# EAGLE design logic (EAGLE 5.07)
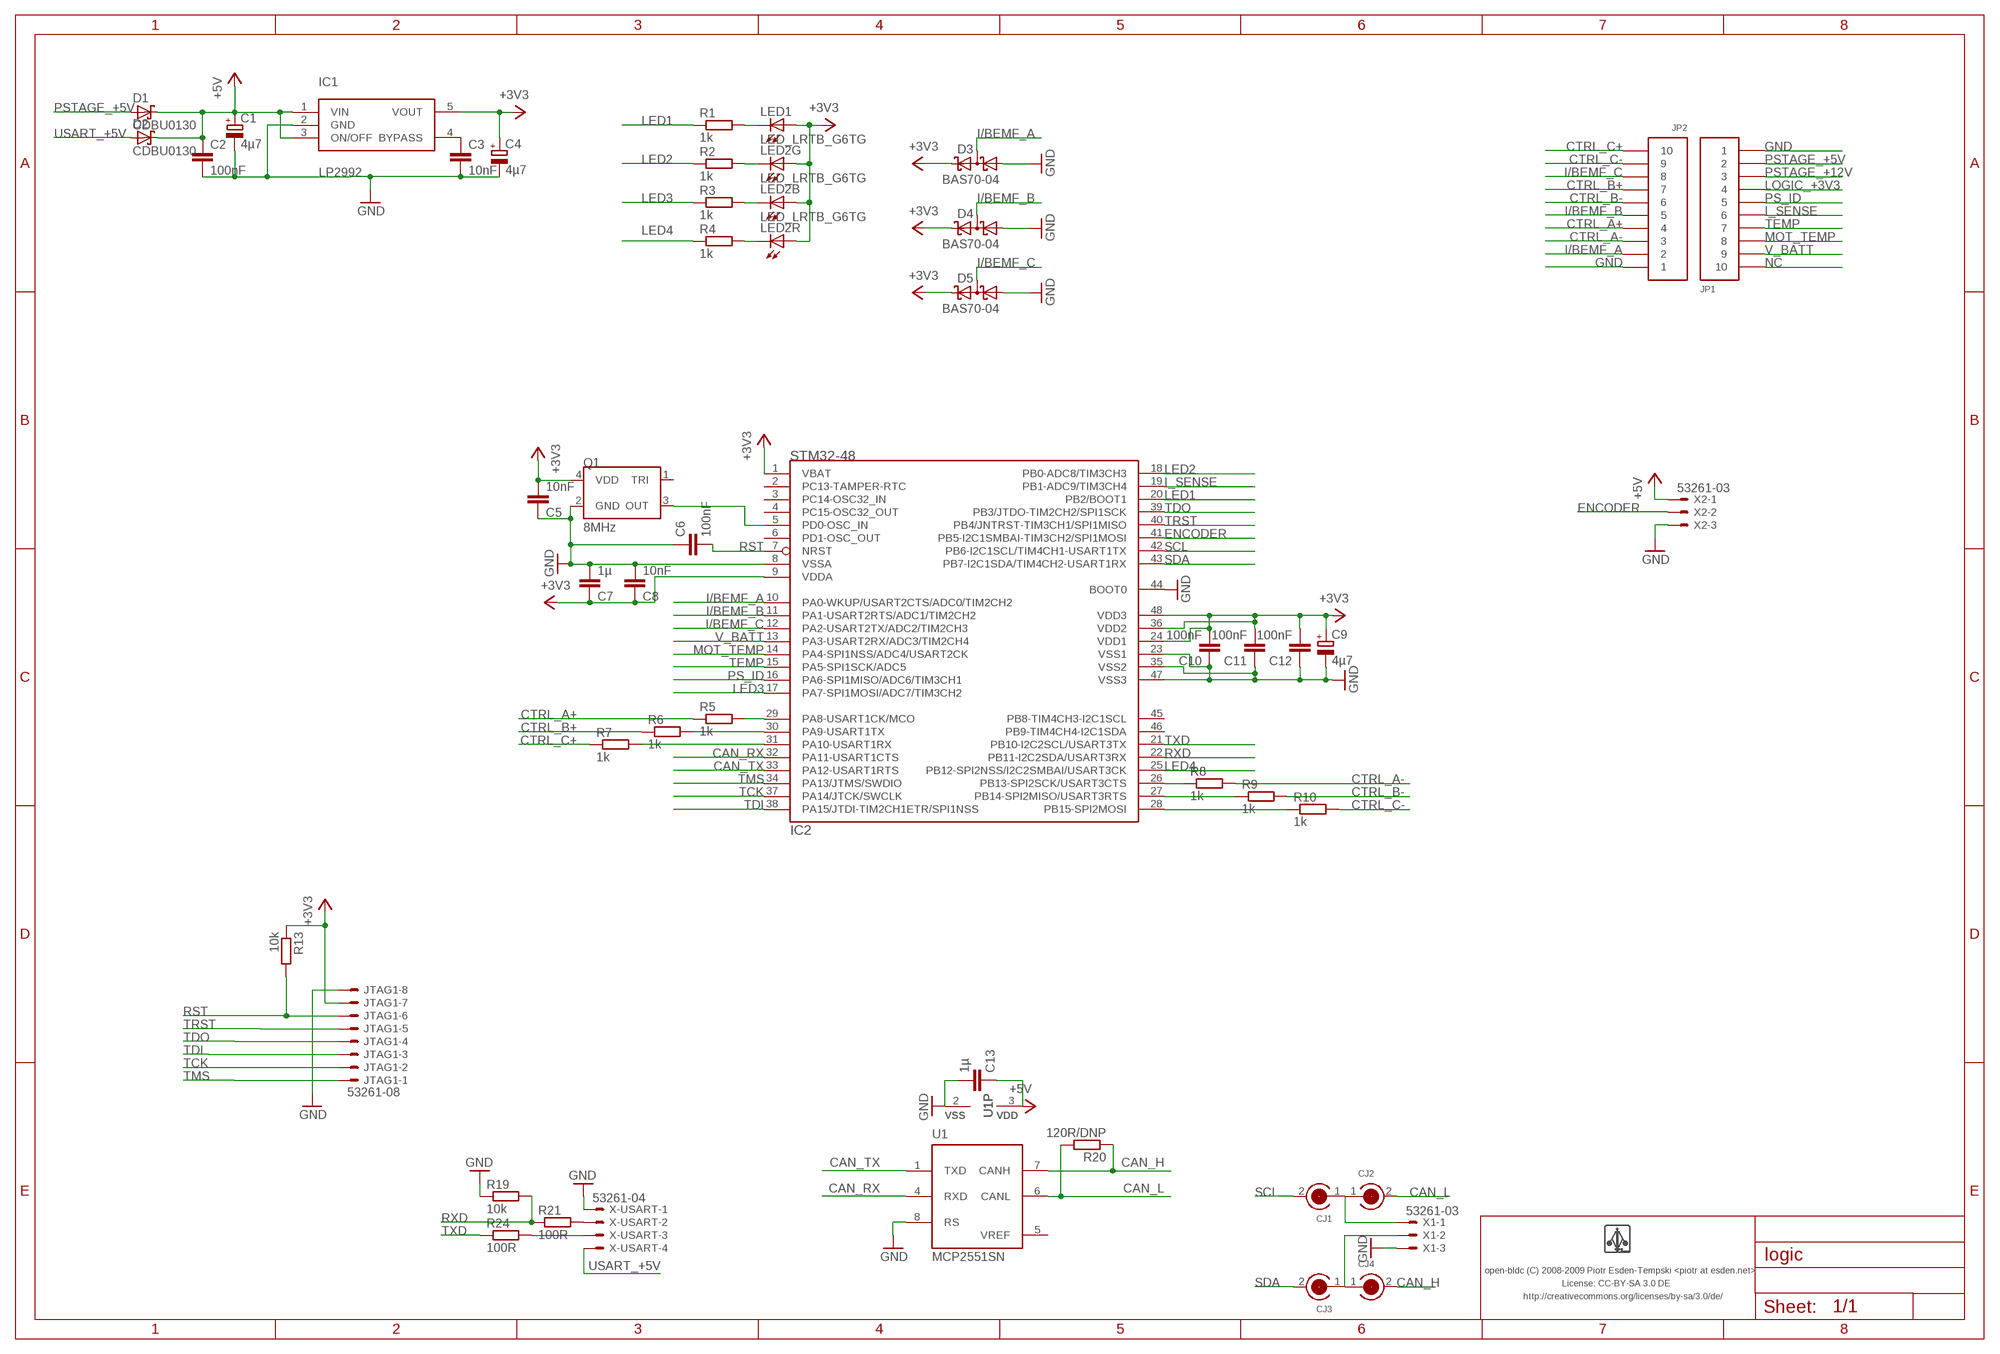
[diagram p0: schematic, sheet 1]

## Parts
C1  4µ7  CPOL-EUA/3216-18R  [A/3216-18R]
C2  100nF  C-EUC0603  [C0603]
C3  10nF  C-EUC0603  [C0603]
C4  4µ7  CPOL-EUA/3216-18R  [A/3216-18R]
C5  10nF  C-EUC0603  [C0603]
C6  100nF  C-EUC0603  [C0603]
C7  1µ  C-EUC0603  [C0603]
C8  10nF  C-EUC0603  [C0603]
C9  4µ7  CPOL-EUA/3216-18R  [A/3216-18R]
C10  100nF  C-EUC0603  [C0603]
C11  100nF  C-EUC0603  [C0603]
C12  100nF  C-EUC0603  [C0603]
C13  1µ  C-EUC0603  [C0603]
CJ1  CIRC_JMP  [CIRC_JMP]
CJ2  CIRC_JMP  [CIRC_JMP]
CJ3  CIRC_JMP  [CIRC_JMP]
CJ4  CIRC_JMP  [CIRC_JMP]
D1  CDBU0130  SCHOTTKY-DIODE0603  [SOD523]
D2  CDBU0130  SCHOTTKY-DIODE0603  [SOD523]
D3  BAS70-04  [SOT23]
D4  BAS70-04  [SOT23]
D5  BAS70-04  [SOT23]
IC1  LP2992  [SOT23-5]
IC2  STM32-48  [LQFP48]
JP1  PIN_HDR_1.27MM_10  PIN_HDR_1.27MM_10_TH  [PIN_HDR_1.27MM_10]
JP2  PIN_HDR_1.27MM_10  PIN_HDR_1.27MM_10_TH  [PIN_HDR_1.27MM_10]
JTAG1  53261-08  [53261-08]
LED1  AMBER  LEDCHIP-LED0603  [CHIP-LED0603]
LED2  LED_LRTB_G6TG  [PLCC6]
Q1  8MHz  ASE_ASCILLATOR  [ASE_OSCILLATOR]
R1  1k  R-EU_R0603  [R0603]
R2  1k  R-EU_R0603  [R0603]
R3  1k  R-EU_R0603  [R0603]
R4  1k  R-EU_R0603  [R0603]
R5  1k  R-EU_R0603  [R0603]
R6  1k  R-EU_R0603  [R0603]
R7  1k  R-EU_R0603  [R0603]
R8  1k  R-EU_R0603  [R0603]
R9  1k  R-EU_R0603  [R0603]
R10  1k  R-EU_R0603  [R0603]
R13  10k  R-EU_R0603  [R0603]
R19  10k  R-EU_R0603  [R0603]
R20  120R/DNP  R-EU_R0603  [R0603]
R21  100R  R-EU_R0603  [R0603]
R24  100R  R-EU_R0603  [R0603]
U1  MCP2551SN  [SO-08]
U$1  LOGO  [LOGO]
X1  53261-03  [53261-03]
X2  53261-03  [53261-03]
X-USART  53261-04  [53261-04]

## Nets
+3V3: C4.+ C5.2 C7.1 C8.1 C9.+ C10.2 C11.2 C12.2 D3.2(C2) D4.2(C2) D5.2(C2) IC1.5(VOUT) IC2.1(VBAT) IC2.9(VDDA) IC2.24(VDD1) IC2.36(VDD2) IC2.48(VDD3) JTAG1.7 LED1.A LED2.A1(R:A) LED2.A2(G:A) LED2.A3(B:A) Q1.4(VDD) R13.1
+5V: C1.+ C2.1 C13.1 D1.C D2.C IC1.1(VIN) IC1.3(ON/OFF) U1.3(VDD) X2.1
CAN_H: CJ4.2 R20.1 U1.7(CANH)
CAN_L: CJ2.2 R20.2 U1.6(CANL)
CAN_RX: IC2.32(PA11-USART1CTS) U1.4(RXD)
CAN_TX: IC2.33(PA12-USART1RTS) U1.1(TXD)
CTRL_A+: JP2.P$4 R5.1
CTRL_A-: JP2.P$3 R8.2
CTRL_B+: JP2.P$7 R6.1
CTRL_B-: JP2.P$6 R9.2
CTRL_C+: JP2.P$10 R7.1
CTRL_C-: JP2.P$9 R10.2
ENCODER: IC2.41(PB5-I2C1SMBAI-TIM3CH2/SPI1MOSI) X2.2
GND: C1.- C2.2 C3.2 C4.- C5.1 C6.1 C7.2 C8.2 C9.- C10.1 C11.1 C12.1 C13.2 D3.1(A1) D4.1(A1) D5.1(A1) IC1.2(GND) IC2.8(VSSA) IC2.23(VSS1) IC2.35(VSS2) IC2.44(BOOT0) IC2.47(VSS3) JP1.P$1 JP2.P$1 JTAG1.8 Q1.2(GND) R19.1 U1.2(VSS) U1.8(RS) X1.3 X2.3 X-USART.1
I/BEMF_A: D3.3(C1A2) IC2.10(PA0-WKUP/USART2CTS/ADC0/TIM2CH2) JP2.P$2
I/BEMF_B: D4.3(C1A2) IC2.11(PA1-USART2RTS/ADC1/TIM2CH2) JP2.P$5
I/BEMF_C: D5.3(C1A2) IC2.12(PA2-USART2TX/ADC2/TIM2CH3) JP2.P$8
I_SENSE: IC2.19(PB1-ADC9/TIM3CH4) JP1.P$6
LED1: IC2.20(PB2/BOOT1) R1.1
LED2: IC2.18(PB0-ADC8/TIM3CH3) R2.1
LED3: IC2.17(PA7-SPI1MOSI/ADC7/TIM3CH2) R3.1
LED4: IC2.25(PB12-SPI2NSS/I2C2SMBAI/USART3CK) R4.1
LOGIC_+3V3: JP1.P$4
MOT_TEMP: IC2.14(PA4-SPI1NSS/ADC4/USART2CK) JP1.P$8
N$1: CJ3.1 CJ4.1 X1.2
N$2: CJ1.1 CJ2.1 X1.1
N$3: LED1.C R1.2
N$4: LED2.C1(R:C) R4.2
N$5: LED2.C3(B:C) R3.2
N$9: R21.2 X-USART.2
N$10: LED2.C2(G:C) R2.2
N$20: R24.2 X-USART.3
N$22: C3.1 IC1.4(BYPASS)
N$33: IC2.26(PB13-SPI2SCK/USART3CTS) R8.1
N$36: IC2.27(PB14-SPI2MISO/USART3RTS) R9.1
N$39: IC2.28(PB15-SPI2MOSI) R10.1
N$40: IC2.5(PD0-OSC_IN) Q1.3(OUT)
N$41: IC2.29(PA8-USART1CK/MCO) R5.2
N$42: IC2.30(PA9-USART1TX) R6.2
N$45: IC2.31(PA10-USART1RX) R7.2
NC: JP1.P$10
PS_ID: IC2.16(PA6-SPI1MISO/ADC6/TIM3CH1) JP1.P$5
PSTAGE_+5V: D1.A JP1.P$2
PSTAGE_+12V: JP1.P$3
RST: C6.2 IC2.7(NRST) JTAG1.6 R13.2
RXD: IC2.22(PB11-I2C2SDA/USART3RX) R19.2 R21.1
SCL: CJ1.2 IC2.42(PB6-I2C1SCL/TIM4CH1-USART1TX)
SDA: CJ3.2 IC2.43(PB7-I2C1SDA/TIM4CH2-USART1RX)
TCK: IC2.37(PA14/JTCK/SWCLK) JTAG1.2
TDI: IC2.38(PA15/JTDI-TIM2CH1ETR/SPI1NSS) JTAG1.3
TDO: IC2.39(PB3/JTDO-TIM2CH2/SPI1SCK) JTAG1.4
TEMP: IC2.15(PA5-SPI1SCK/ADC5) JP1.P$7
TMS: IC2.34(PA13/JTMS/SWDIO) JTAG1.1
TRST: IC2.40(PB4/JNTRST-TIM3CH1/SPI1MISO) JTAG1.5
TXD: IC2.21(PB10-I2C2SCL/USART3TX) R24.1
USART_+5V: D2.A X-USART.4
V_BATT: IC2.13(PA3-USART2RX/ADC3/TIM2CH4) JP1.P$9
Unconnected: IC2.2(PC13-TAMPER-RTC) IC2.3(PC14-OSC32_IN) IC2.4(PC15-OSC32_OUT) IC2.6(PD1-OSC_OUT) IC2.45(PB8-TIM4CH3-I2C1SCL) IC2.46(PB9-TIM4CH4-I2C1SDA) Q1.1(TRI)

## Notes on the sheet
- open-bldc (C) 2008-2009 Piotr Esden-Tempski <piotr at esden.net>
- License: CC-BY-SA 3.0 DE
- http://creativecommons.org/licenses/by-sa/3.0/de/

## Power pins joined to a net without a drawn wire
VREF: U1.5(VREF)

## Library data of the parts
C1 C4 C9 = rcl:CPOL-EU: POLARIZED CAPACITOR, European symbol
C2 C3 C5-C8 C10-C13 = rcl:C-EU: CAPACITOR, European symbol
CJ1-CJ4 = fancy_jumpers:CIRC_JMP
D1 D2 = diode:SCHOTTKY-DIODE: Schottky Diode
D3-D5 = diode:BAS70-04: Silicon Schottky Diodes General-purpose diode for high-speed switching
IC1 = open-bldc:LP2992
IC2 = open-bldc:STM32-48
JP1 JP2 = open-bldc:PIN_HDR_1.27MM_10
JTAG1 = con-molex:53?-08: CONNECTOR wire to board 1.25 mm (.049 inch) pitch header
LED1 = led:LED: LED OSRAM: - CHIPLED LG R971, LG N971, LY N971, LG Q971, LY Q971, LO R971, LY R971 LH N974, LH R974 LS Q976, LO Q976, LY Q976 LO Q996 - Hyper CHIPLED LW Q18S LB Q993, LB Q99A, LB R99A - SideLED LS A670, LO A670, LY A670, LG A670, LP A670 LB A673, LV A673, LT A673, LW A673 LH A674 LY A675 LS A676, LA A676, LO A676, LY A676, LW A676 LS A679, LY A679, LG A679 - Hyper Micro SIDELED® LS Y876, LA Y876, LO Y876, LY Y876 LT Y87S - SmartLED LW L88C, LW L88S LB L89C, LB L89S, LG L890 LS L89K, LO L89K, LY L89K LS L896, LA L896, LO L896, LY L896 - TOPLED LS T670, LO T670, LY T670, LG T670, LP T670 LSG T670, LSP T670, LSY T670, LOP T670, LYG T670 LG T671, LOG T671, LSG T671 LB T673, LV T673, LT T673, LW T673 LH T674 LS T676, LA T676, LO T676, LY T676, LB T676, LH T676, LSB T676, LW T676 LB T67C, LV T67C, LT T67C, LS T67K, LO T67K, LY T67K, LW E67C LS E67B, LA E67B, LO E67B, LY E67B, LB E67C, LV E67C, LT E67C LW T67C LS T679, LY T679, LG T679 LS T770, LO T770, LY T770, LG T770, LP T770 LB T773, LV T773, LT T773, LW T773 LH T774 LS E675, LA E675, LY E675, LS T675 LS T776, LA T776, LO T776, LY T776, LB T776 LHGB T686 LT T68C, LB T68C - Hyper Mini TOPLED® LB M676 - Mini TOPLED Santana® LG M470 LS M47K, LO M47K, LY M47K Source: http://www.osram.convergy.de LUXEON: - LUMILED® LXK2-PW12-R00, LXK2-PW12-S00, LXK2-PW14-U00, LXK2-PW14-V00 LXK2-PM12-R00, LXK2-PM12-S00, LXK2-PM14-U00 LXK2-PE12-Q00, LXK2-PE12-R00, LXK2-PE12-S00, LXK2-PE14-T00, LXK2-PE14-U00 LXK2-PB12-K00, LXK2-PB12-L00, LXK2-PB12-M00, LXK2-PB14-N00, LXK2-PB14-P00, LXK2-PB14-Q00 LXK2-PR12-L00, LXK2-PR12-M00, LXK2-PR14-Q00, LXK2-PR14-R00 LXK2-PD12-Q00, LXK2-PD12-R00, LXK2-PD12-S00 LXK2-PH12-R00, LXK2-PH12-S00 LXK2-PL12-P00, LXK2-PL12-Q00, LXK2-PL12-R00 Source: www.luxeon.com KINGBRIGHT: KA-3528ASYC Source: www.kingbright.com
LED2 = open-bldc:LED_LRTB_G6TG
Q1 = open-bldc:ASE_ASCILLATOR
R1-R10 R19-R21 R24 = rcl:R-EU_: RESISTOR, European symbol
R13 = resistor:R-EU_: RESISTOR, European symbol
U1 = microchip_can:MCP2551: High Speed CAN tranceiver
U$1 = open-bldc:LOGO
X1 X2 = con-molex:53?-03: CONNECTOR wire to board 1.25 mm (.049 inch) pitch header
X-USART = con-molex:53?-04: CONNECTOR wire to board 1.25 mm (.049 inch) pitch header

## Board
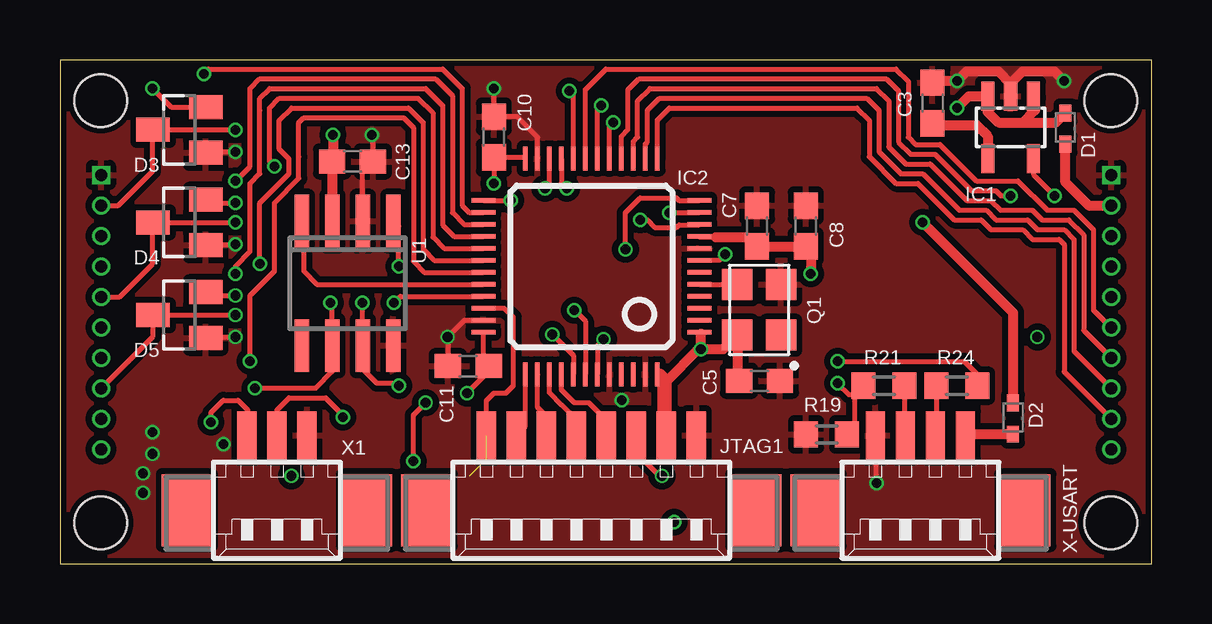
[diagram p1: board, top side]
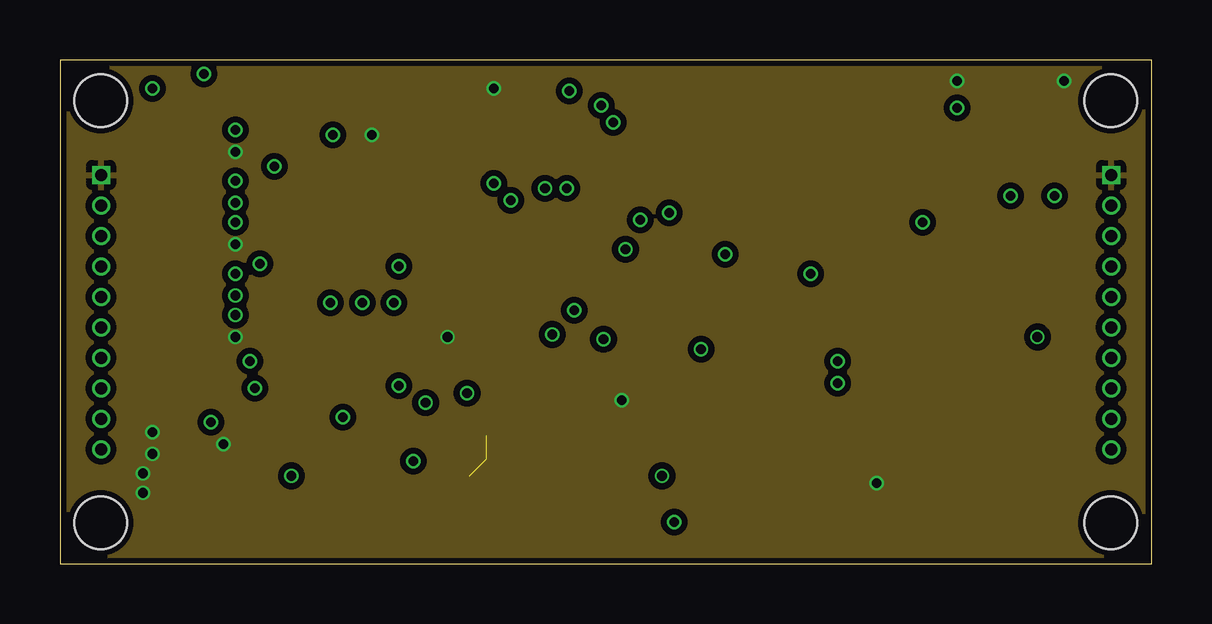
[diagram p2: board, inner layer Route2]
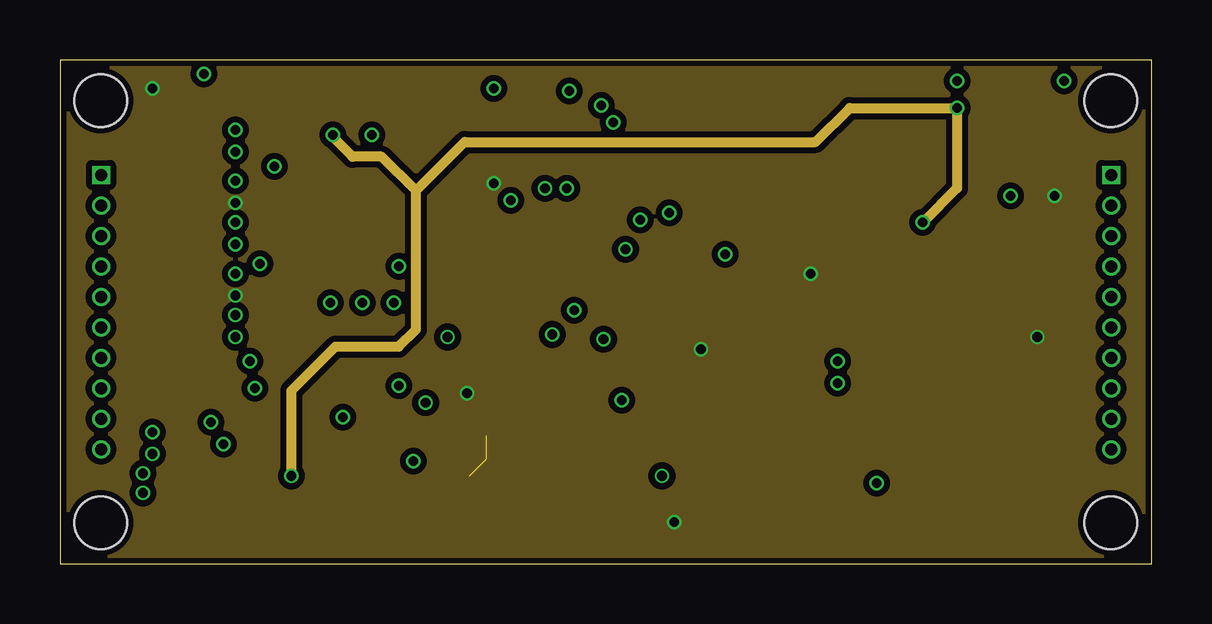
[diagram p3: board, inner layer Route15]
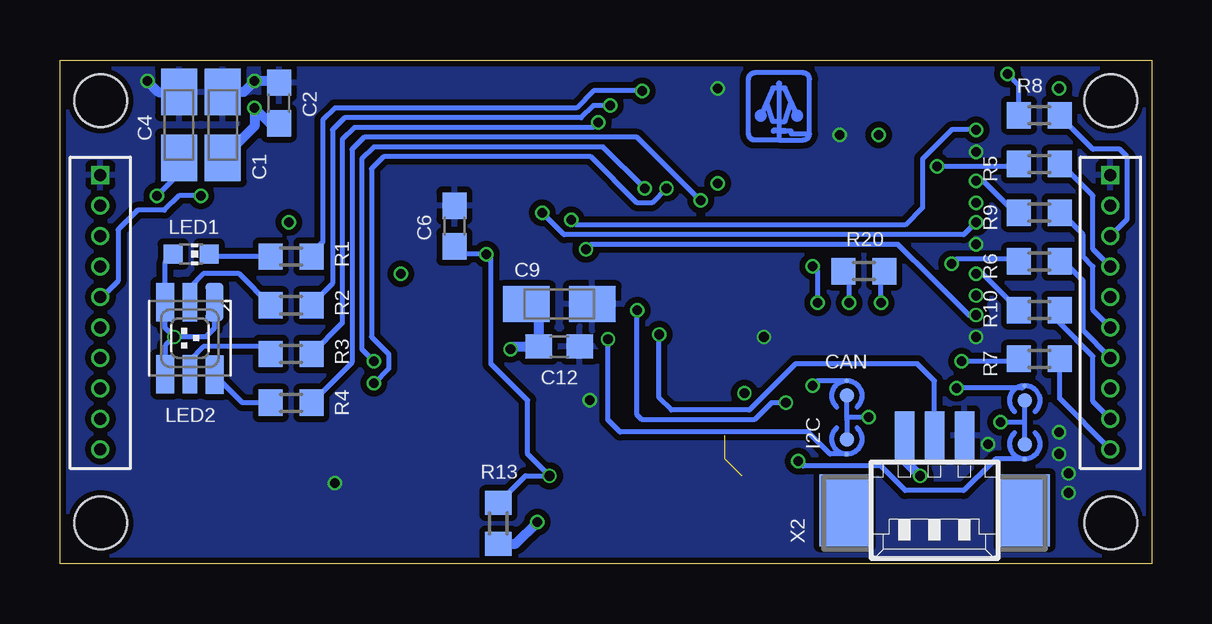
[diagram p4: board, bottom side, seen from below]

Size 45.5 x 21 mm. Coordinates in mm from the lower left corner, seen from the top.
Outline: 0,0 45.5,0 45.5,21 0,21 0,0
Copper layers (1*2+15*16): Top 0.035mm / dielectric 0.75mm / Route2 0.035mm / dielectric 0.15mm / Route15 0.035mm / dielectric 0.75mm / Bottom 0.035mm
Design rules "default *": minimum track width 8mil, minimum drill 0.4mm, track to track 8mil, track to pad 8mil, pad to pad 8mil, via to via 8mil, smd to smd 8mil, copper to edge 10mil, drill to drill 8mil, minimum pad ring 0.1mm, minimum via ring 0.1mm, stop-mask expansion 4mil, vias tented up to drill 16mil, thermal gap 10mil
Holes 2.2 mm at 1.7,1.7 43.8,1.7 43.8,19.3 1.7,19.3

### Footprints (pad centres in the part's own frame; a part is rotated, then mirrored left to right if it is on the bottom)
A/3216-18R = smd 1.95 x 1.5: + 1.375,0; - -1.375,0
C0603 = smd 1.1 x 1: 1 -0.85,0; 2 0.85,0
CIRC_JMP = smd 0.61 x 0.61: 1 0,0 | smd 0.203 x 0.203: 2 0,0.617
SOD523 = smd 0.7 x 0.5: A 0.7,0; C -0.6,0
SOT23 = smd 1 x 1.4: 1 -0.95,-1.1; 2 0.95,-1.1; 3 0,1.1
SOT23-5 = smd 0.55 x 1.2: 1 -0.95,-1.3; 2 0,-1.3; 3 0.95,-1.3; 4 0.95,1.3; 5 -0.95,1.3
LQFP48 = smd 0.2 x 1: 1 -2.75,-4.5; 2 -2.25,-4.5; 3 -1.75,-4.5; 4 -1.25,-4.5; 5 -0.75,-4.5; 6 -0.25,-4.5; 7 0.25,-4.5; 8 0.75,-4.5; 9 1.25,-4.5; 10 1.75,-4.5; 11 2.25,-4.5; 12 2.75,-4.5; 25 2.75,4.5; 26 2.25,4.5; 27 1.75,4.5; 28 1.25,4.5; 29 0.75,4.5; 30 0.25,4.5; 31 -0.25,4.5; 32 -0.75,4.5; 33 -1.25,4.5; 34 -1.75,4.5; 35 -2.25,4.5; 36 -2.75,4.5 | smd 1 x 0.2: 13 4.5,-2.75; 14 4.5,-2.25; 15 4.5,-1.75; 16 4.5,-1.25; 17 4.5,-0.75; 18 4.5,-0.25; 19 4.5,0.25; 20 4.5,0.75; 21 4.5,1.25; 22 4.5,1.75; 23 4.5,2.25; 24 4.5,2.75; 37 -4.5,2.75; 38 -4.5,2.25; 39 -4.5,1.75; 40 -4.5,1.25; 41 -4.5,0.75; 42 -4.5,0.25; 43 -4.5,-0.25; 44 -4.5,-0.75; 45 -4.5,-1.25; 46 -4.5,-1.75; 47 -4.5,-2.25; 48 -4.5,-2.75
PIN_HDR_1.27MM_10 = drill 0.5 square: P$1 0,0 | drill 0.5 round: P$2 0,1.27; P$3 0,2.54; P$4 0,3.81; P$5 0,5.08; P$6 0,6.35; P$7 0,7.62; P$8 0,8.89; P$9 0,10.16; P$10 0,11.43
53261-08 = smd 0.8 x 2: 1 4.375,-2.5; 2 3.125,-2.5; 3 1.875,-2.5; 4 0.625,-2.5; 5 -0.625,-2.5; 6 -1.875,-2.5; 7 -3.125,-2.5; 8 -4.375,-2.5 | smd 2.1 x 3: S1 6.875,0.625; S2 -6.875,0.625
CHIP-LED0603 = smd 0.8 x 0.8: A 0,-0.75; C 0,0.75
PLCC6 = smd 0.75 x 1.6: A1 -1.025,-1.5; A2 1.025,-1.5; A3 1.025,1.5; C1 -1.025,1.525 | smd 0.6 x 1.6: C2 0,-1.5; C3 0,1.5
ASE_OSCILLATOR = smd 1.295 x 1.27: 1 -1.041,-0.902; 2 1.067,-0.902; 3 1.067,0.927; 4 -1.041,0.927
R0603 = smd 1 x 1.1: 1 -0.85,0; 2 0.85,0
SO-08 = smd 0.6 x 2.2: 1 -1.905,-2.6; 2 -0.635,-2.6; 3 0.635,-2.6; 4 1.905,-2.6; 5 1.905,2.6; 6 0.635,2.6; 7 -0.635,2.6; 8 -1.905,2.6
53261-03 = smd 0.8 x 2: 1 1.25,-2.5; 2 0,-2.5; 3 -1.25,-2.5 | smd 2.1 x 3: S1 3.75,0.625; S2 -3.75,0.625
53261-04 = smd 0.8 x 2: 1 1.875,-2.5; 2 0.625,-2.5; 3 -0.625,-2.5; 4 -1.875,-2.5 | smd 2.1 x 3: S1 4.375,0.625; S2 -4.375,0.625

### Placement (x,y rotation side)
C1  38.71,18.29 270 bottom
C2  36.37,19.2 90 bottom
C3  36.37,19.2 90 top
C4  40.54,18.29 270 bottom
C5  29.16,7.62 180 top
C6  29.06,14.07 270 bottom
C7  29.06,14.07 90 top
C8  31.09,14.07 90 top
C9  24.69,10.82 180 bottom
C10  18.08,17.78 270 top
C11  17.02,8.23 0 top
C12  24.69,9.04 180 bottom
C13  12.19,16.76 0 top
CJ1  5.28,4.98 180 bottom
CJ2  5.28,6.81 0 bottom
CJ3  12.7,5.18 180 bottom
CJ4  12.7,7.01 0 bottom
D1  41.91,18.19 270 top
D2  39.73,6.1 270 top
D3  4.98,18.08 90 top
D4  4.98,14.22 90 top
D5  4.98,10.36 90 top
IC1  39.62,18.19 180 top
IC2  22.15,12.4 90 top
JP1  43.81,16.2 180 bottom
JP2  1.71,16.2 180 bottom
JTAG1  22.15,2.84 180 top
LED1  40.03,12.9 270 bottom
LED2  40.08,9.4 180 bottom
Q1  29.16,10.57 90 top
R1  35.86,12.8 180 bottom
R2  35.86,10.77 180 bottom
R3  35.86,8.74 180 bottom
R4  35.86,6.71 180 bottom
R5  4.67,16.66 180 bottom
R6  4.67,12.6 180 bottom
R7  4.67,8.53 180 bottom
R8  4.67,18.69 0 bottom
R9  4.67,14.63 0 bottom
R10  4.67,10.57 0 bottom
R13  27.23,1.68 90 bottom
R19  31.95,5.38 0 top
R20  11.99,12.19 0 bottom
R21  34.34,7.42 0 top
R24  37.39,7.42 180 top
U1  11.99,11.68 180 top
U$1  15.54,18.95 0 bottom
X1  9.04,2.84 180 top
X2  9.04,2.84 180 bottom
X-USART  35.86,2.84 180 top

### Tracks (layer width: path | path; a pad name or v marks a point on that pad's centre or on a via)
+3V3  (via drill 0.4)
  Top 0.203: D3.2 4.64,19.04 v3.86,19.81 | D5.2 6.22,11.18 v7.32,11.18 | IC1.5 40.57,16.22 v41.45,15.34 | v18.09,15.85 C10.2 19.36,16.93 IC2.24 | v16.97,7.11 17.87,8.01 C11.2 17.65,8.45 IC2.36 | 28.23,7.7 C5.2 | 26.72,9.57 IC2.1 | 25.02,7.89 IC2.48 | 27.33,13.61 26.68,13.61 IC2.9 | v7.32,15.04 6.08,15.04 D4.2
  Top 0.406: v26.72,8.94 26.72,9.57 | 25.3,7.62 25.09,7.42 25.09,6.3 | v26.72,8.94 26.62,8.94 25.3,7.62 | v26.72,8.94 27.65,8.94 Q1.4 28.23,7.7 C5.2 | 25.3,7.62 25.3,5.37 JTAG1.7 | 27.33,13.61 28.65,13.61 29.04,13.22 C7.1 C8.1 31.1,13.21 31.29,13.02 v31.29,12.09
  Top 0.457: 25.3,7.62 25.02,7.89
  Bottom 0.203: LED2.A1 39.06,9.81 39.42,9.45 v40.74,9.45 | v40.74,9.45 41.11,9.81 LED2.A2 41.11,12.58 LED1.A | LED2.A3 41.11,9.08 v40.74,9.45 | C4.+ 40.54,16.26 v41.45,15.34
  Bottom 0.406: v26.72,8.94 26.62,9.04 C12.2 25.54,10.29 C9.+ | v25.6,1.73 26.5,0.83 R13.1
  pour Route15 (isolate 0.254): 0,0 0,21.03 45.52,21.03 45.52,0
+5V  (via drill 0.4)
  Top 0.406: 40.13,18.39 39.12,18.39 38.67,18.83 IC1.3 37.88,19.49 v37.39,19 | 40.13,18.39 40.64,18.9 40.64,19.42 IC1.1 | D1.C 41.51,18.39 40.13,18.39 | U1.3 11.34,14.3 C13.1 11.38,16.8 v11.38,17.88 | D2.C 39.73,10.46 v35.97,14.22
  Route15 0.406: 14.83,15.54 13.41,16.97 12.19,16.97 11.38,17.78 v11.38,17.88 | 14.83,15.54 16.87,17.58 31.5,17.58 32.92,19 v37.39,19 37.39,15.65 v35.97,14.22 | v9.65,3.66 9.65,7.21 11.48,9.04 14.12,9.04 14.83,9.75 14.83,15.54
  Bottom 0.406: C1.+ 37.39,18.23 v37.39,19 36.74,18.35 C2.1 | X2.1 10.29,4.3 v9.65,3.66
CAN_H  (via drill 0.4)
  Top 0.203: v12.6,10.87 12.62,10.85 U1.7 12.62,8.11 13.21,7.53 14.01,7.53 v14.12,7.42
  Bottom 0.203: R20.1 12.6,11.95 v12.6,10.87 | CJ4.2 13.91,7.63 v14.12,7.42
CAN_L  (via drill 0.4)
  Top 0.203: v11.28,10.87 11.35,10.79 U1.6 11.35,8 10.67,7.32 v8.13,7.32
  Bottom 0.203: R20.2 11.28,12.05 v11.28,10.87 | CJ2.2 5.39,7.32 v8.13,7.32
CAN_RX
  Top 0.203: IC2.32 10.71,11.64 10.16,12.19 10.16,14.21 U1.4
CAN_TX  (via drill 0.4)
  Top 0.203: IC2.33 14.19,11.14 v13.92,10.87 | v14.12,12.39 14.12,14.05 U1.1
  Bottom 0.203: v13.92,10.87 13.92,12.19 v14.12,12.39
CTRL_A+
  Bottom 0.203: JP2.P$4 2.44,13.12 2.44,15.34 3.76,16.66 R5.1
CTRL_A-
  Bottom 0.203: JP2.P$3 1.02,14.36 1.02,16.97 1.32,17.27 2.44,17.27 3.82,18.66 R8.2
CTRL_B+
  Bottom 0.203: JP2.P$7 2.85,9.71 2.85,11.79 3.66,12.6 R6.1
CTRL_B-
  Bottom 0.203: JP2.P$6 2.44,10.58 2.44,12.39 2.85,12.8 2.85,13.72 3.76,14.63 R9.2
CTRL_C+
  Bottom 0.203: JP2.P$10 3.82,6.88 R7.1
CTRL_C-
  Bottom 0.203: JP2.P$9 2.44,6.77 2.44,8.64 3.82,10.02 R10.2
ENCODER  (via drill 0.4)
  Top 0.203: IC2.41 21.4,8.68 v20.52,9.55
  Bottom 0.203: v20.52,9.55 20.52,6.91 20.02,6.4 16.76,6.4 14.83,8.33 9.75,8.33 9.04,7.62 X2.2
GND  (via drill 0.4)
  Top 0.203: D3.1 6.11,17.17 v7.32,17.17 | D4.1 6.11,13.31 v7.32,13.31 | D5.1 6.11,9.45 v7.32,9.45 | v13.01,17.88 13.04,17.84 C13.2 12.62,16.35 U1.2 | IC2.23 19.91,16.91 19.91,17.78 19.06,18.63 C10.1 v18.09,19.81 | C11.1 16.17,9.46 16.85,10.14 IC2.35 16.88,10.14 | X-USART.1 34.04,5.34 v34.04,3.35
  Top 0.406: v41.86,20.12 41.45,20.52 40.13,20.52 39.62,20.02 | 39.62,20.02 IC1.2 | 39.62,20.02 39.12,20.52 37.8,20.52 v37.39,20.12 36.44,20.12 C2.2
  Bottom 0.406: C4.- 41.41,19.66 v41.86,20.12 | C1.- 37.84,19.66 v37.39,20.12 36.44,20.12 C2.2
  other vias: 16.15,9.45 23.42,6.81 3.86,5.49 3.86,4.57 3.45,3.76 3.45,2.95 6.81,4.98
  pour Top (isolate 0.254): 0,0 0,21.03 45.52,21.03 45.52,0
  pour Bottom (isolate 0.254): 0,0 0,21.03 45.52,21.03 45.52,0
  pour Route2 (isolate 0.254): 0,0 0,21.03 45.52,21.03 45.52,0
I/BEMF_A  (via drill 0.4)
  Top 0.203: D3.3 | JP2.P$2 2.43,14.93 3.86,16.36 3.86,18.07 D3.3 | D3.3 v7.32,18.09 | v24.18,14.33 24.49,14.33 24.79,14.02 25.7,14.02 25.81,14.12 26.63,14.12 IC2.10
  Bottom 0.203: v7.32,18.09 8.33,18.09 9.55,16.87 9.55,14.83 10.26,14.12 23.98,14.12 v24.18,14.33
I/BEMF_B  (via drill 0.4)
  Top 0.203: JP2.P$5 2.48,11.12 3.86,12.5 3.86,14.21 D4.3 v7.32,14.22 | v25.4,14.63 26.63,14.63 IC2.11
  Bottom 0.203: v7.32,14.22 7.82,13.72 24.49,13.72 v25.4,14.63
I/BEMF_C  (via drill 0.4)
  Top 0.203: JP2.P$8 3.88,9.48 D5.3 v7.32,10.36 | v23.57,13.11 23.57,14.63 24.18,15.24 25.7,15.24 25.8,15.14 IC2.12
  Bottom 0.203: v7.32,10.36 7.62,10.36 9.14,11.89 10.57,13.31 23.37,13.31 v23.57,13.11
I_SENSE
  Top 0.203: JP1.P$6 43.8,9.85 43.08,10.57 43.08,13.92 42.27,14.73 41.15,14.73 39.93,15.95 38.2,15.95 36.68,17.48 35.66,17.48 35.36,17.78 35.36,20.12 34.85,20.62 22.76,20.62 21.9,19.77 IC2.19
LED1  (via drill 0.4)
  Top 0.203: IC2.20 21.4,19.55 v21.23,19.71
  Bottom 0.203: v21.23,19.71 23.27,19.71 23.98,19 34.04,19 34.54,18.49 34.54,13.41 35.02,12.94 R1.1
LED2  (via drill 0.4)
  Top 0.203: v22.55,19.1 22.4,18.94 IC2.18
  Bottom 0.203: R2.1 35.02,10.81 34.14,11.68 34.14,18.09 33.63,18.59 23.77,18.59 23.27,19.1 v22.55,19.1
LED3  (via drill 0.4)
  Top 0.203: v23.06,18.39 22.9,18.23 IC2.17
  Bottom 0.203: R3.1 33.73,10.02 33.73,17.68 33.22,18.19 23.27,18.19 v23.06,18.39
LED4  (via drill 0.4)
  Top 0.203: IC2.25 v18.79,15.14 v18.8,15.14
  Bottom 0.203: v18.8,15.14 21.44,17.78 32.82,17.78 33.33,17.27 33.33,8.4 R4.1
MOT_TEMP
  Top 0.203: JP1.P$8 42.27,8.86 42.27,13.51 41.86,13.92 40.74,13.92 40.34,14.33 39.01,14.33 38.61,14.73 37.49,14.73 35.97,16.26 35.05,16.26 34.14,17.17 34.14,18.9 33.63,19.41 24.99,19.41 24.49,18.9 24.49,17.58 24.4,17.49 IC2.14
N$1  (via drill 0.4)
  Top 0.203: v11.79,6.1 11.79,6.2 11.07,6.91 9.55,6.91 9.04,6.4 X1.2
  Bottom 0.203: 12.7,6.1 12.7,5.99 CJ3.1 | 12.7,6.1 CJ4.1 | v11.79,6.1 12.7,6.1
N$2  (via drill 0.4)
  Top 0.203: v6.3,5.89 6.3,6.3 6.81,6.81 7.42,6.81 7.82,6.4 7.82,5.38 X1.1
  Bottom 0.203: 5.28,5.89 CJ2.1 | CJ1.1 5.28,5.89 | 5.28,5.89 v6.3,5.89
N$3
  Bottom 0.203: LED1.C 39.18,12.8 R1.2
N$4
  Bottom 0.203: R4.2 37.89,6.71 LED2.C1
N$5
  Bottom 0.203: R3.2 37.02,9.04 39.52,9.04 40.08,8.48 LED2.C3
N$9
  Top 0.203: X-USART.2 35.19,5.39 R21.2
N$10
  Bottom 0.203: R2.2 38.04,12.09 39.52,12.09 40.08,11.53 LED2.C2
N$20
  Top 0.203: X-USART.3 36.54,5.39 R24.2
N$22
  Top 0.406: C3.1 36.44,18.29 38.2,18.29 38.67,17.82 IC1.4
N$33  (via drill 0.4)
  Top 0.203: IC2.26 17.05,14.64 16.76,14.94 16.76,15.04 16.76,19.81 15.95,20.62 6.2,20.62 v5.99,20.42
  Bottom 0.203: R8.1 5.52,19.95 v5.99,20.42
N$36  (via drill 0.4)
  Top 0.203: IC2.27 16.84,14.14 16.36,14.63 16.36,19.51 15.65,20.22 8.33,20.22 7.92,19.81 7.92,16.56 v7.32,15.95
  Bottom 0.203: R9.1 5.69,14.63 7.01,15.95 v7.32,15.95
N$39  (via drill 0.4)
  Top 0.203: IC2.28 16.43,13.64 15.95,14.12 15.95,19.1 15.24,19.81 8.74,19.81 8.33,19.41 8.33,18.9 8.33,16.26 7.92,15.85 7.92,13.01 7.32,12.39 v7.32,12.09
  Bottom 0.203: R10.1 7.05,12.09 v7.32,12.09
N$40
  Top 0.203: Q1.3 28.22,11.64 IC2.5
N$41  (via drill 0.4)
  Top 0.203: IC2.29 16.01,13.14 15.54,13.61 15.54,18.8 14.94,19.41 9.14,19.41 8.74,19 8.74,16.76 v8.94,16.56
  Bottom 0.203: R5.2 5.62,16.56 v8.94,16.56
N$42  (via drill 0.4)
  Top 0.203: v8.33,12.5 8.33,15.04 9.55,16.26 9.55,16.87 9.14,17.27 9.14,18.49 9.65,19 14.53,19 15.14,18.39 15.14,13.11 15.6,12.64 IC2.30
  Bottom 0.203: R6.2 5.62,12.7 7.72,12.7 8.13,12.7 v8.33,12.5
N$45  (via drill 0.4)
  Top 0.203: v7.92,8.43 7.92,11.18 8.94,12.19 8.94,15.04 9.96,16.05 9.96,16.97 9.96,18.39 10.16,18.59 14.33,18.59 14.73,18.19 14.73,12.6 15.19,12.14 IC2.31
  Bottom 0.203: R7.2 5.62,8.43 v7.92,8.43
PS_ID  (via drill 0.4)
  Top 0.203: v39.62,15.34 39.22,15.34 39.01,15.54 38,15.54 36.47,17.07 35.46,17.07 34.95,17.58 34.95,19.71 34.44,20.22 24.14,20.22 23.67,19.75 23.67,18.09 23.4,17.81 IC2.16
  Bottom 0.203: JP1.P$5 43.74,11.12 43.08,11.79 43.08,13.92 42.27,14.73 41.15,14.73 40.54,15.34 v39.62,15.34
PSTAGE_+5V
  Top 0.406: D1.A 41.91,15.9 42.88,14.94 JP1.P$2
RST  (via drill 0.4)
  Top 0.203: v25.09,3.66 24.99,3.66 23.98,4.67 23.98,5.3 JTAG1.6 | IC2.7 27.48,12.64 v27.74,12.9
  Bottom 0.203: R13.2 26.1,3.66 v25.09,3.66 26.01,4.57 26.01,6.81 27.53,8.33 27.53,12.7 v27.74,12.9 28.74,12.9 C6.2
RXD  (via drill 0.4)
  Top 0.203: 33.12,7.05 R21.1 | 33.12,7.05 33.12,5.79 32.8,5.47 R19.2 | IC2.22 20.4,15.83 v20.22,15.65 | v32.41,7.52 32.88,7.05 33.12,7.05
  Bottom 0.203: v20.22,15.65 20.83,15.04 21.44,15.04 23.37,16.97 32,16.97 32.51,16.46 32.51,9.45 31.8,8.74 31.8,8.13 v32.41,7.52
SCL  (via drill 0.4)
  Top 0.203: IC2.42 21.9,10.11 v21.44,10.57 | v15.24,6.71 14.73,6.2 v14.73,4.27
  Bottom 0.203: v21.44,10.57 21.44,6.2 21.23,5.99 16.56,5.99 15.85,6.71 v15.24,6.71 | v14.73,4.27 14.53,4.06 11.28,4.06 10.26,3.05 7.82,3.05 6.71,4.17 6.51,4.36 CJ1.2
SDA  (via drill 0.4)
  Top 0.203: IC2.43 22.4,9.09 v22.66,9.35
  Bottom 0.203: v22.66,9.35 22.66,5.99 22.15,5.49 14.33,5.49 13.4,4.56 CJ3.2
TCK
  Top 0.203: JTAG1.2 19.4,5.72 IC2.37
TDI
  Top 0.203: JTAG1.3 20.27,6.14 19.91,6.5 19.91,7.88 IC2.38
TDO
  Top 0.203: JTAG1.4 21.52,6.01 20.93,6.6 20.4,7.13 IC2.39
TEMP
  Top 0.203: JP1.P$7 42.67,9.72 42.67,13.72 42.06,14.33 40.95,14.33 40.54,14.73 39.22,14.73 38.81,15.14 37.8,15.14 36.27,16.66 35.26,16.66 34.54,17.37 34.54,19.3 34.04,19.81 24.59,19.81 24.08,19.3 24.08,17.78 23.9,17.6 IC2.15
TMS  (3 unrouted)
  Top 0.203: JTAG1.1 17.77,6.8 18.09,7.11 18.59,7.11 18.9,7.42 18.9,10.26 18.51,10.64 IC2.34
TRST
  Top 0.203: JTAG1.5 22.77,5.98 22.05,6.71 21.44,6.71 20.9,7.24 IC2.40
TXD  (via drill 0.4)
  Top 0.203: IC2.21 20.9,15.88 v21.13,15.65 | v32.41,8.43 37.69,8.43 38.2,7.92 38.2,7.45 R24.1
  Bottom 0.203: v21.13,15.65 22.86,17.37 32.41,17.37 32.92,16.87 32.92,8.94 v32.41,8.43
USART_+5V
  Top 0.406: X-USART.4 37.79,5.4 D2.A
V_BATT
  Top 0.203: JP1.P$9 41.86,8 41.86,13.31 41.66,13.51 40.54,13.51 40.13,13.92 38.81,13.92 38.41,14.33 37.29,14.33 35.76,15.85 34.85,15.85 33.73,16.97 33.73,18.49 33.22,19 25.4,19 24.9,18.5 IC2.13

### Text on the board
bNames: CAN | I2C